# Altium schematic sheet NuevosGateDriver.SchDoc
size A4; SheetNumber: 2; SheetTotal: 6
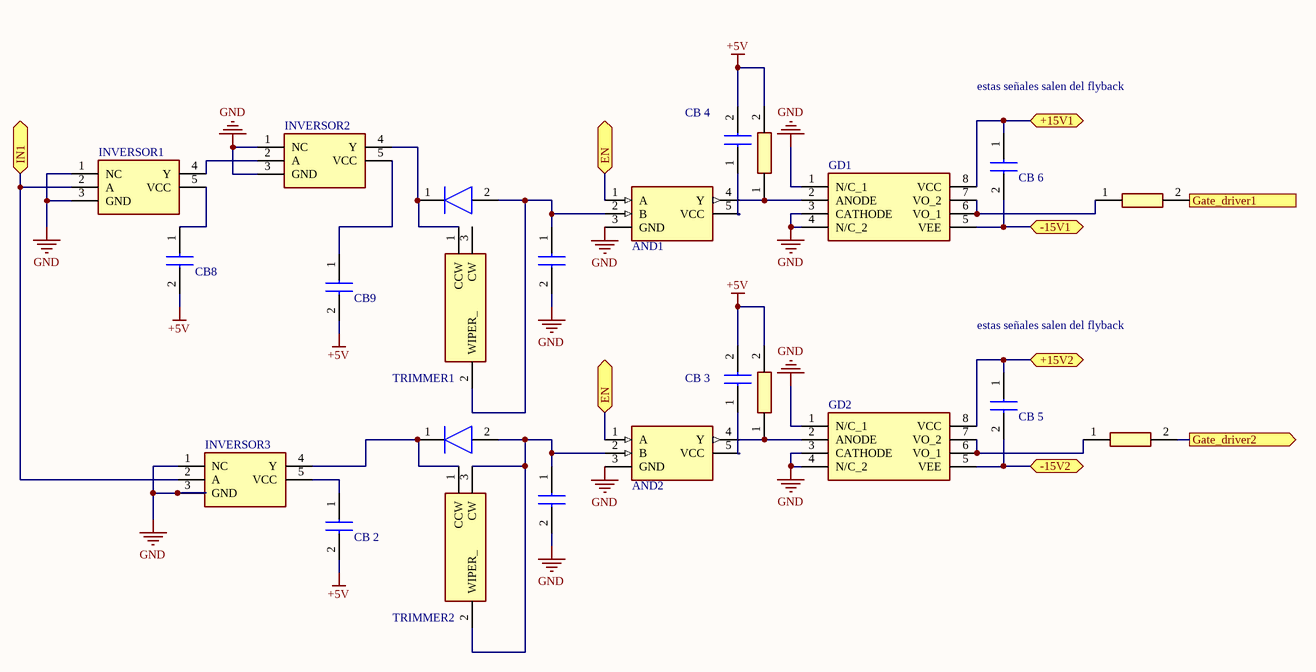
[diagram p0: NuevosGateDriver.SchDoc]

## Parts
AND1  SN74AHC1G09DCKR  [SOT65P210X110-5N]  (value not drawn)
AND2  SN74AHC1G09DCKR  [SOT65P210X110-5N]  (value not drawn)
CB8  0.1 uF  [CAPC2012X94N]  (value not drawn)
CB9  0.1 uF  [CAPC2012X94N]  (value not drawn)
CB_2  0.1 uF  [CAPC2012X94N]  (value not drawn)
CB_3  0.1 uF  [CAPC2012X94N]  (value not drawn)
CB_4  0.1 uF  [CAPC2012X94N]  (value not drawn)
CB_5  0.1 uF  [CAPC2012X94N]  (value not drawn)
CB_6  0.1 uF  [CAPC2012X94N]  (value not drawn)
CG1  C0805Y102K3RACTU  [CAPC2012X98N]  (value not drawn)
CG2  C0805Y102K3RACTU  [CAPC2012X98N]  (value not drawn)
DS1  BAS85-GS08  [BAQ33GS08]  (value not drawn)
DS2  BAS85-GS08  [BAQ33GS08]  (value not drawn)
GD1  HCPL-3120  [DIP762W65P254L965H470Q8N]  (value not drawn)
GD2  HCPL-3120  [DIP762W65P254L965H470Q8N]  (value not drawn)
GR1  RC0603JR-13100RL  [RESC1608X55N]  (value not drawn)
GR2  RC0603JR-13100RL  [RESC1608X55N]  (value not drawn)
GR3  RC0603JR-13100RL  [RESC1608X55N]  (value not drawn)
GR4  RC0603JR-13100RL  [RESC1608X55N]  (value not drawn)
INVERSOR1  SN74AHC1G14DRLR  [SOTFL50P160X60-5N]  (value not drawn)
INVERSOR2  SN74AHC1G14DRLR  [SOTFL50P160X60-5N]  (value not drawn)
INVERSOR3  SN74AHC1G14DRLR  [SOTFL50P160X60-5N]  (value not drawn)
TRIMMER1  ST-4ETB203  [ST4ETB203]  (value not drawn)
TRIMMER2  ST-4ETB203  [ST4ETB203]  (value not drawn)

## Ports
+15V1 (bidir), +15V2 (bidir), -15V1 (bidir), -15V2 (bidir), EN (bidir), Gate_driver1 (out), Gate_driver2 (out), IN1 (bidir)

## Nets
+5V: CB8.2 CB9.2 CB_2.2 CB_3.2 CB_4.2 GR1.2 GR2.2
GND: AND1.3(GND) AND2.3(GND) CG1.2 CG2.2 GD1.1(N/C_1) GD1.3(CATHODE) GD1.4(N/C_2) GD2.1(N/C_1) GD2.3(CATHODE) GD2.4(N/C_2) INVERSOR1.1(NC) INVERSOR1.3(GND) INVERSOR2.1(NC) INVERSOR2.3(GND) INVERSOR3.1(NC) INVERSOR3.3(GND)
+15V1: CB_6.1 GD1.8(VCC) ; port +15V1
+15V2: CB_5.1 GD2.8(VCC) ; port +15V2
-15V1: CB_6.2 GD1.5(VEE) ; port -15V1
-15V2: CB_5.2 GD2.5(VEE) ; port -15V2
EN: AND1.1(A) AND2.1(A) ; port EN
Gate_driver1: GR3.2 ; port Gate_driver1
Gate_driver2: GR4.2 ; port Gate_driver2
IN1: INVERSOR1.2(A) INVERSOR3.2(A) ; port IN1
NetAND1_2: AND1.2(B) CG1.1 DS1.2(A) TRIMMER1.2(WIPER_)
NetAND1_4: AND1.4(Y) GD1.2(ANODE) GR1.1
NetAND1_5: AND1.5(VCC) CB_4.1
NetAND2_2: AND2.2(B) CG2.1 DS2.2(A) TRIMMER2.2(WIPER_) TRIMMER2.3(CW)
NetAND2_4: AND2.4(Y) GD2.2(ANODE) GR2.1
NetAND2_5: AND2.5(VCC) CB_3.1
NetCB8_1: CB8.1 INVERSOR1.5(VCC)
NetCB9_1: CB9.1 INVERSOR2.5(VCC)
NetCB_2_1: CB_2.1 INVERSOR3.5(VCC)
NetDS1_1: DS1.1(K) INVERSOR2.4(Y) TRIMMER1.1(CCW)
NetDS2_1: DS2.1(K) INVERSOR3.4(Y) TRIMMER2.1(CCW)
NetGD1_6: GD1.6(VO_1) GD1.7(VO_2) GR3.1
NetGD2_6: GD2.6(VO_1) GD2.7(VO_2) GR4.1
NetINVERSOR1_4: INVERSOR1.4(Y) INVERSOR2.2(A)

Not connected (* = marked no-connect by the designer): TRIMMER1 3(CW)

## Notes on the sheet
- estas señales salen del flyback

## Library data of the parts
AND1 AND2 = SN74AHC1G09DCKR: TEXAS INSTRUMENTS         SN74AHC1G09DCKR             AND Gate, ACH Family, 2 Input, 1 Gate, 25 mA, 2V to 5.5V, SC-70-5; Quiescent Current: 1uA; Output Current: 25mA; Number of Inputs: 2; Propagation Delay: 7.5ns; Number of Outputs: 1; Low Level Output Current: 8mA; Datasheet Link: http://www.ti.com/lit/gpn/sn74ahc1g09; Height: 1.1mm; Manufacturer_Name: Texas Instruments; Manufacturer_Part_Number: SN74AHC1G09DCKR; Supplier 1: Digi-Key; Manufacturer: Texas Instruments; Manufacturer Part Number: SN74AHC1G09DCKR; RoHS: Yes; Category: Logic Gates; Stock 1: 19244; Pricing 1: 1=0.40000, 10=0.29700, 25=0.25960, 100=0.16810, 250=0.13912, 500=0.11130, 1000=0.08533 (USD); Mount: Surface Mount; Case/Package: SC; Number of Pins: 5; Min Operating Temperature: -55°C; Max Operating Temperature: 125°C; Max Supply Voltage: 5.5V; Min Supply Voltage: 2V; Logic Function: AND GATE; Packaging: Tape and Reel; Package Quantity: 3000; Output Voltage: 5.5V; Number of Circuits: 1; Number of Gates: 1; Number of Elements: 1; Number of Bits: 1; Series: 74AHC; Technology: CMOS; Radiation Hardening: No; REACH SVHC: No SVHC; Lead Free: Lead Free; RoHS Compliant: Yes; ComponentLink1URL: https://datasheet.ciiva.com/1869/sn74ahc1g09-1869442.pdf?src-supplier=Digi-Key; ComponentLink1Description: https://datasheet.ciiva.com/1869/sn74ahc1g09-1869442.pdf?src-supplier=Digi-Key; ComponentLink2URL: https://datasheet.ciiva.com/4817/scls724b-115396-4817364.pdf?src-supplier=Mouser; ComponentLink2Description: https://datasheet.ciiva.com/4817/scls724b-115396-4817364.pdf?src-supplier=Mouser; ComponentLink3URL: https://datasheet.ciiva.com/1869/sn74ahc1g09-1869443.pdf?src-supplier=Digi-Key; ComponentLink3Description: https://datasheet.ciiva.com/1869/sn74ahc1g09-1869443.pdf?src-supplier=Digi-Key; ComponentLink4URL: https://datasheet.ciiva.com/1869/sn74ahc1g09-1869444.pdf?src-supplier=Digi-Key; ComponentLink4Description: https://datasheet.ciiva.com/1869/sn74ahc1g09-1869444.pdf?src-supplier=Digi-Key; ComponentLink5URL: https://datasheet.ciiva.com/14310/sn74ahc1g09-14310535.pdf?src-supplier=Avnet; ComponentLink5Description: https://datasheet.ciiva.com/14310/sn74ahc1g09-14310535.pdf?src-supplier=Avnet; ComponentLink6URL: https://datasheet.ciiva.com/41677/1864448-41677365.pdf?src-supplier=Newark; ComponentLink6Description: https://datasheet.ciiva.com/41677/1864448-41677365.pdf?src-supplier=Newark; Supplier Part Number 1: 296-29203-1-ND
CB8 CB9 CB_2-CB_6 = 0805YC104KAT2A: Multilayer Ceramic Capacitors MLCC - SMD/SMT 16V .1uF X7R 0805 10%; Manufacturer_Name: AVX; Manufacturer: Kyocera AVX; Capacitance: 100nF; Dissipation Factor: 12.5%; Insulation Resistance: 100GR; Datasheet Link: https://spicat.avx.com/product/mlcc/chartview/0805YC104KAT2A/DataSheet/X7R; Height: 0.94mm; Manufacturer_Part_Number: 0805YC104KAT2A; Mouser Part Number: 581-0805YC104K; Mouser Price/Stock: https://www.mouser.co.uk/ProductDetail/AVX/0805YC104KAT2A?qs=0j3vzYx9OgS3bRufCc82qg%3D%3D; Arrow Part Number: 0805YC104KAT2A; Arrow Price/Stock: https://www.arrow.com/en/products/0805yc104kat2a/avx; Supplier 1: Digi-Key; Manufacturer Part Number: 0805YC104KAT2A; RoHS: Yes; Category: Ceramic Capacitors; Stock 1: 61419; Pricing 1: 1=0.30000, 10=0.20700, 50=0.12420, 100=0.10490, 500=0.07176, 1000=0.06348 (USD); Mount: Surface Mount; Case/Package: 0805; Number of Pins: 2; Case Code (Metric): 2012; Case Code (Imperial): 0805; Min Operating Temperature: -55°C; Max Operating Temperature: 125°C; Tolerance: 10%; Dielectric: X7R; Packaging: Tape and Reel; Voltage Rating: 16V; Package Quantity: 1; Termination: SMD/SMT; Voltage Rating (DC): 16V; Series: -; Construction: Flat; Length: 2.01mm; Width: 0.049inch; Depth: 1.25mm; Thickness: 0.037inch; Radiation Hardening: No; REACH SVHC: No SVHC; Lead Free: Lead Free; RoHS Compliant: Yes; ComponentLink1URL: https://datasheet.ciiva.com/206/cx7r-206011.pdf?src-supplier=Digi-Key; ComponentLink1Description: https://datasheet.ciiva.com/206/cx7r-206011.pdf?src-supplier=Digi-Key; ComponentLink2URL: https://datasheet.ciiva.com/5418/cx7r-5418479.pdf?src-supplier=Mouser; ComponentLink2Description: https://datasheet.ciiva.com/5418/cx7r-5418479.pdf?src-supplier=Mouser; ComponentLink3URL: https://datasheet.ciiva.com/2988/cx7r-2988050.pdf?src-supplier=Avnet; ComponentLink3Description: https://datasheet.ciiva.com/2988/cx7r-2988050.pdf?src-supplier=Avnet; ComponentLink4URL: https://datasheet.ciiva.com/14906/cx7r-14906278.pdf?src-supplier=Digi-Key; ComponentLink4Description: https://datasheet.ciiva.com/14906/cx7r-14906278.pdf?src-supplier=Digi-Key; ComponentLink5URL: https://datasheet.ciiva.com/15212/getdatasheetpartid-150472-15212621.pdf?src-supplier=Verical; ComponentLink5Description: https://datasheet.ciiva.com/15212/getdatasheetpartid-150472-15212621.pdf?src-supplier=Verical; ComponentLink6URL: https://datasheet.ciiva.com/28613/1679506-28613143.pdf?src-supplier=Element14; ComponentLink6Description: https://datasheet.ciiva.com/28613/1679506-28613143.pdf?src-supplier=Element14; ComponentLink7URL: https://datasheet.ciiva.com/16623/cx7r-16623414.pdf?src-supplier=Avnet+Europe; ComponentLink7Description: https://datasheet.ciiva.com/16623/cx7r-16623414.pdf?src-supplier=Avnet+Europe; Supplier Part Number 1: 478-7961-1-ND
CG1 CG2 = C0805Y102K3RACTU: Multilayer Ceramic Capacitors MLCC - SMD/SMT 25volts 1000pF 10% X7R; Manufacturer_Name: Kemet; Capacitance: 1nF; Voltage Rating (DC): 25V; Datasheet Link: https://www.kemet.com/specsheet/C0805Y102K3RACTU; Height: 0.98mm; Manufacturer_Part_Number: C0805Y102K3RACTU; Mouser Part Number: 80-C0805Y102K3R; Mouser Price/Stock: https://www.mouser.com/Search/Refine.aspx?Keyword=80-C0805Y102K3R; Manufacturer: KEMET; Manufacturer Part Number: C0805Y102K3RACTU; RoHS: Yes; Category: Capacitors; Stock 1: 8015; Pricing 1: 1=0.43000, 10=0.30100, 50=0.30100, 100=0.18100, 1000=0.11400, 10000=0.10200 (USD); Case/Package: 0805; Case Code (Imperial): 0805; Case Code (Metric): 2012; Weight: 0.000194oz; Dielectric Material: Ceramic; Min Operating Temperature: -55°C; Max Operating Temperature: 125°C; Packaging: Tape and Reel; Tolerance: 10%; Dielectric: X7R; Termination: SMD/SMT; Series: C0805Y; RoHS Compliant: Yes; ComponentLink1URL: http://www.mouser.com/ds/2/212/KEM_C1015_X7R_FF-CAP_SMD-1101148.pdf?src-supplier=Mouser; ComponentLink1Description: http://www.mouser.com/ds/2/212/KEM_C1015_X7R_FF-CAP_SMD-1101148.pdf?src-supplier=Mouser
  CG1: Supplier 1: Digi-Key; Supplier Part Number 1: 399-15433-1-ND
  CG2: Supplier 1: Mouser; Supplier Part Number 1: 80-C0805Y102K3R
DS1 DS2 = BAS85-GS08: VISHAY - BAS85-GS08 - Small Signal Schottky Diode, Single, 30 V, 200 mA, 800 mV, 600 mA, 125 °C; Manufacturer: Vishay Semiconductors; Recovery Time: 5ns; Max Surge Current: 600mA; Forward Voltage: 800mV; Forward Current: 200mA; Max Reverse Current: 2uA; Max Repetitive Reverse Voltage (Vrrm): 30V; Power Dissipation: 200mW; Current Rating: 200A; Datasheet Link: https://www.vishay.com/docs/85510/bas85.pdf; Height: 1.6mm; Manufacturer_Name: Vishay; Manufacturer_Part_Number: BAS85-GS08; Supplier 1: Allied Electronics; Manufacturer Part Number: BAS85-GS08; RoHS: Yes; Category: Rectifier Diodes; Stock 1: 12500; Pricing 1: 1=0.06300, 12500=0.06000, 625000=0.05900 (USD); Mount: Surface Mount; Number of Pins: 2; Contact Plating: Tin,Silver; Min Operating Temperature: -55°C; Max Operating Temperature: 125°C; Package Quantity: 1; Packaging: Tape and Reel; Average Rectified Current: 200mA; Reverse Recovery Time: 5ns; Max Reverse Leakage Current: 2uA; Peak Non-Repetitive Surge Current: 600mA; Max Forward Surge Current (Ifsm): 600mA; Element Configuration: Single; Current: 200mA; Voltage: 30V; Max Reverse Voltage (DC): 30V; Diameter: 1.6mm; Length: 0.145inch; Width: 1.6mm; Radiation Hardening: No; REACH SVHC: Unknown; Lead Free: Lead Free; RoHS Compliant: Yes; ComponentLink1URL: https://datasheet.ciiva.com/1202/1354484-1202985.pdf?src-supplier=Farnell; ComponentLink1Description: https://datasheet.ciiva.com/1202/1354484-1202985.pdf?src-supplier=Farnell; ComponentLink2URL: https://datasheet.ciiva.com/4715/bas85-88986-4715157.pdf?src-supplier=Mouser; ComponentLink2Description: https://datasheet.ciiva.com/4715/bas85-88986-4715157.pdf?src-supplier=Mouser; ComponentLink3URL: https://datasheet.ciiva.com/17069/0900766b80de2cb8-17069417.pdf?src-supplier=Allied+Electronics; ComponentLink3Description: https://datasheet.ciiva.com/17069/0900766b80de2cb8-17069417.pdf?src-supplier=Allied+Electronics; ComponentLink4URL: https://datasheet.ciiva.com/1240/1749352-1240576.pdf?src-supplier=Newark; ComponentLink4Description: https://datasheet.ciiva.com/1240/1749352-1240576.pdf?src-supplier=Newark; ComponentLink5URL: https://datasheet.ciiva.com/13950/bas85-13950054.pdf?src-supplier=Digi-Key; ComponentLink5Description: https://datasheet.ciiva.com/13950/bas85-13950054.pdf?src-supplier=Digi-Key; ComponentLink6URL: https://datasheet.ciiva.com/13950/bas85-13950058.pdf?src-supplier=Digi-Key; ComponentLink6Description: https://datasheet.ciiva.com/13950/bas85-13950058.pdf?src-supplier=Digi-Key; ComponentLink7URL: https://datasheet.ciiva.com/8281/bas85-8281903.pdf?src-supplier=Avnet; ComponentLink7Description: https://datasheet.ciiva.com/8281/bas85-8281903.pdf?src-supplier=Avnet; ComponentLink8URL: https://datasheet.ciiva.com/16298/bas85-16298175.pdf?src-supplier=Future+Electronics; ComponentLink8Description: https://datasheet.ciiva.com/16298/bas85-16298175.pdf?src-supplier=Future+Electronics; ComponentLink9URL: https://datasheet.ciiva.com/16941/70061833-16941564.pdf?src-supplier=Allied+Electronics; ComponentLink9Description: https://datasheet.ciiva.com/16941/70061833-16941564.pdf?src-supplier=Allied+Electronics; ComponentLink10URL: https://datasheet.ciiva.com/25936/bas85-25936302.pdf?src-supplier=Avnet+Europe; ComponentLink10Description: https://datasheet.ciiva.com/25936/bas85-25936302.pdf?src-supplier=Avnet+Europe; Supplier Part Number 1: 70062025
GD1 GD2 = HCPL-3120: Optocoupler Drive Push-Pull 1-CH 30V 1500V 8-Pin PDIP; Manufacturer_Name: Avago Technologies; Manufacturer: Broadcom Avago; Number of Channels: 1; Propagation Delay: 500ns; Rise Time: 100ns; Pulse Width Distortion (PWD): 300ns; Direction: Unidirectional; Max Power Dissipation: 295mW; Forward Current: 25mA; Forward Voltage: 1.5V; Reverse Breakdown Voltage: 5V; High Level Output Current: 2A; Fall Time: 0.1us; Isolation Voltage: 3.75kV; Max Output Current: 2.5A; Input Type: DC; Approvals: CSA,UR; Datasheet Link: https://docs.broadcom.com/docs/AV02-0161EN; Height: 4.7mm; Mouser2 Part Number: 630-HCPL-3120; Mouser2 Price/Stock: https://www.mouser.com/Search/Refine.aspx?Keyword=630-HCPL-3120; Manufacturer_Part_Number: HCPL-3120; Supplier 1: Digi-Key; Manufacturer Part Number: HCPL-3120; RoHS: No; Category: Optocouplers; Stock 1: 3108; Pricing 1: 1=4.42000, 10=3.12300, 100=2.55790, 500=2.15642, 1000=2.10450 (USD); Mount: Through Hole; Case/Package: PDIP; Number of Pins: 8; Min Operating Temperature: -40°C; Max Operating Temperature: 100°C; Packaging: Rail/Tube; Package Quantity: 50; Series: -; Low Level Output Current: 2A; Turn-On Delay Time: 500ns; Number of Elements: 1; Power Dissipation: 295mW; Output Type: PUSH-PULL; Radiation Hardening: No; RoHS Compliant: No; Lead Free: Contains Lead; ComponentLink1URL: https://datasheet.ciiva.com/19453/1550434-19453924.pdf?src-supplier=Jameco; ComponentLink1Description: https://datasheet.ciiva.com/19453/1550434-19453924.pdf?src-supplier=Jameco; ComponentLink2URL: https://datasheet.ciiva.com/15119/getdatasheetpartid-141584-15119757.pdf?src-supplier=Verical; ComponentLink2Description: https://datasheet.ciiva.com/15119/getdatasheetpartid-141584-15119757.pdf?src-supplier=Verical; Supplier Part Number 1: 516-1121-5-ND
GR1 GR2 = RC0603JR-13100RL: YAGEO - RC0603JR-13100RL - RES, THICK FILM, 100R, 5%, 0.1W, 0603; Manufacturer_Name: YAGEO (PHYCOMP); Resistance: 47; Power Rating: 100mW; Voltage Rating: 50V; Temperature Coefficient: 100ppm/°C; Datasheet Link: http://www.yageo.com/documents/recent/PYu-RC0603_51_RoHS_L_v5.pdf; Height: 0.55mm; Manufacturer_Part_Number: RC0603JR-13100RL; Supplier 1: Digi-Key; Manufacturer: Yageo; Manufacturer Part Number: RC0603JR-13100RL; RoHS: Yes; Category: Chip SMD Resistors; Stock 1: 37865; Pricing 1: 1=0.10000, 10=0.02000, 100=0.00800, 1000=0.00360, 2500=0.00312, 5000=0.00258 (USD); Case/Package: 0603; Number of Pins: 2; Case Code (Imperial): 0603; Case Code (Metric): 1608; Min Operating Temperature: -55°C; Max Operating Temperature: 155°C; Tolerance: 5%; Packaging: Tape and Reel; Resistor Type: Thick Film; Termination: SMD/SMT; Voltage Rating (DC): 50V; Series: RC; Construction: Rectangular; Resistance Tolerance: 5%; Length: 1.6mm; Width: 0.8mm; Depth: 0.8mm; REACH SVHC: No SVHC; Military Standard: Not; Lead Free: Lead Free; RoHS Compliant: Yes; ComponentLink1URL: https://datasheet.ciiva.com/12558/rc0603-272842-12558903.pdf?src-supplier=Mouser; ComponentLink1Description: https://datasheet.ciiva.com/12558/rc0603-272842-12558903.pdf?src-supplier=Mouser; ComponentLink2URL: https://datasheet.ciiva.com/7983/443971-7983750.pdf?src-supplier=Element14; ComponentLink2Description: https://datasheet.ciiva.com/7983/443971-7983750.pdf?src-supplier=Element14; Supplier Part Number 1: 13-RC0603JR-13100RLCT-ND
GR3 GR4 = RC0603JR-13100RL: Res Thick Film 1218 47 Ohm 5% 1W ±200ppm/C Pad SMD Automotive T/R; Manufacturer_Name: YAGEO (PHYCOMP); Manufacturer: Yageo; Resistance: 100R; Power Rating: 100mW; Voltage Rating: 50V; Temperature Coefficient: 100ppm/°C; Datasheet Link: http://www.yageo.com/documents/recent/PYu-RC0603_51_RoHS_L_v5.pdf; Height: 0.55mm; Manufacturer_Part_Number: RC0603JR-13100RL; Supplier 1: Digi-Key; Manufacturer Part Number: RC0603JR-13100RL; RoHS: Yes; Category: Chip SMD Resistors; Stock 1: 37865; Pricing 1: 1=0.10000, 10=0.02000, 100=0.00800, 1000=0.00360, 2500=0.00312, 5000=0.00258 (USD); Case/Package: 0603; Number of Pins: 2; Case Code (Imperial): 0603; Case Code (Metric): 1608; Min Operating Temperature: -55°C; Max Operating Temperature: 155°C; Tolerance: 5%; Packaging: Tape and Reel; Resistor Type: Thick Film; Termination: SMD/SMT; Voltage Rating (DC): 50V; Series: RC; Construction: Rectangular; Resistance Tolerance: 5%; Length: 1.6mm; Width: 0.8mm; Depth: 0.8mm; REACH SVHC: No SVHC; Military Standard: Not; Lead Free: Lead Free; RoHS Compliant: Yes; ComponentLink1URL: https://datasheet.ciiva.com/12558/rc0603-272842-12558903.pdf?src-supplier=Mouser; ComponentLink1Description: https://datasheet.ciiva.com/12558/rc0603-272842-12558903.pdf?src-supplier=Mouser; ComponentLink2URL: https://datasheet.ciiva.com/7983/443971-7983750.pdf?src-supplier=Element14; ComponentLink2Description: https://datasheet.ciiva.com/7983/443971-7983750.pdf?src-supplier=Element14; Supplier Part Number 1: 13-RC0603JR-13100RLCT-ND; ComponentLink3Description: New link; ComponentLink3URL: *; Supplier 2: Digi-Key; Supplier Part Number 2: RCL47BCT-ND; Stock 2: 6113; Pricing 2: 1=0.62000, 10=0.47600, 100=0.20010, 1000=0.11040 (USD); Weight: 0.001041oz; Package Quantity: 4000; Number of Terminations: 2; Max Power Dissipation: 1W; Features: Automotive AEC-Q200; Height - Seated (Max): 0.024inch; ComponentLink4URL: https://datasheet.ciiva.com/2480/dcrcwe3-2480270.pdf?src-supplier=Digi-Key; ComponentLink4Description: https://datasheet.ciiva.com/2480/dcrcwe3-2480270.pdf?src-supplier=Digi-Key; ComponentLink5URL: https://datasheet.ciiva.com/2480/rcle3-2480271.pdf?src-supplier=Digi-Key; ComponentLink5Description: https://datasheet.ciiva.com/2480/rcle3-2480271.pdf?src-supplier=Digi-Key; ComponentLink6URL: https://datasheet.ciiva.com/2480/rcle3-2480272.pdf?src-supplier=Digi-Key; ComponentLink6Description: https://datasheet.ciiva.com/2480/rcle3-2480272.pdf?src-supplier=Digi-Key; ComponentLink7Description: New link; ComponentLink7URL: *; ComponentLink8Description: New link; ComponentLink8URL: *
INVERSOR1-INVERSOR3 = SN74AHC1G14DRLR: IC INVERTER SCHMITT 1CH SOT5; Manufacturer_Name: Texas Instruments; Number of Inputs: 1; Propagation Delay: 10.6ns; Max Supply Voltage: 5.5V; Min Supply Voltage: 2V; Logic Function: Inverting,Schmitt Trigger,Inverter; Quiescent Current: 1uA; High Level Output Current: -8mA; Low Level Output Current: 8mA; Turn-On Delay Time: 18.5ns; Input Type: SCHMITT TRIGGER; Operating Supply Voltage: 5V; Datasheet Link: http://www.ti.com/lit/gpn/sn74ahc1g14; Height: 0.6mm; Mouser2 Part Number: 595-SN74AHC1G14DRLR; Mouser2 Price/Stock: https://www.mouser.com/Search/Refine.aspx?Keyword=595-SN74AHC1G14DRLR; Manufacturer_Part_Number: SN74AHC1G14DRLR; Supplier 1: Digi-Key; Manufacturer: Texas Instruments; Manufacturer Part Number: SN74AHC1G14DRLR; RoHS: Yes; Category: Logic Gates; Stock 1: 2029; Pricing 1: 1=0.51000, 10=0.41400, 25=0.37840, 100=0.28150, 250=0.25516, 500=0.21116, 1000=0.15836 (USD); Mount: Surface Mount; Case/Package: SOT-553; Number of Pins: 5; Weight: 9.9E-05oz; Min Operating Temperature: -40°C; Max Operating Temperature: 125°C; Package Quantity: 4000; Packaging: Cut Tape; Number of Elements: 1; Number of Circuits: 1; Number of Gates: 1; Number of Bits: 1; Series: SN74AHC1G14; Radiation Hardening: No; Lead Free: Lead Free; RoHS Compliant: Yes; ComponentLink1URL: https://datasheet.ciiva.com/1866/sn74ahc1g14-1866325.pdf?src-supplier=Digi-Key; ComponentLink1Description: https://datasheet.ciiva.com/1866/sn74ahc1g14-1866325.pdf?src-supplier=Digi-Key; Supplier Part Number 1: 296-23232-1-ND
TRIMMER1 TRIMMER2 = ST-4ETB203: TRIMMER 20K OHM 0.25W SMD; Manufacturer_Name: NIDEC COPAL; Resistance: 20kR; Tolerance: 20%; Number of Turns: 1; Max Power Dissipation: 250mW; Temperature Coefficient: 100ppm/°C; Datasheet Link: https://www.nidec-copal-electronics.com/e/catalog/trimmer/st-4.pdf; Height: 2.6mm; Manufacturer_Part_Number: ST-4ETB203; Supplier 1: Digi-Key; Manufacturer: Nidec Copal; Manufacturer Part Number: ST4ETB203; RoHS: Yes; Category: Variable Resistors and Potentiometers; Stock 1: 792; Pricing 1: 1=1.20000, 10=1.06000, 25=0.95440, 50=0.91920, 100=0.88380, 250=0.83072 (USD); Mount: Surface Mount; Color: Black; Weight: 120mg; Min Operating Temperature: -55°C; Max Operating Temperature: 125°C; Termination: Gull Wing; Packaging: Tape and Reel; Resistor Type: Cermet; Series: ST4; Length: 0.197inch; Width: 0.177inch; Radiation Hardening: No; Lead Free: Lead Free; ComponentLink1URL: https://datasheet.ciiva.com/2157/st-4-2157765.pdf?src-supplier=Digi-Key; ComponentLink1Description: https://datasheet.ciiva.com/2157/st-4-2157765.pdf?src-supplier=Digi-Key; ComponentLink2URL: https://datasheet.ciiva.com/2157/st-4-2157766.pdf?src-supplier=Digi-Key; ComponentLink2Description: https://datasheet.ciiva.com/2157/st-4-2157766.pdf?src-supplier=Digi-Key; Supplier Part Number 1: ST4ETB203CT-ND